# EAGLE schematic DrVetinariClock (EAGLE 6.3)
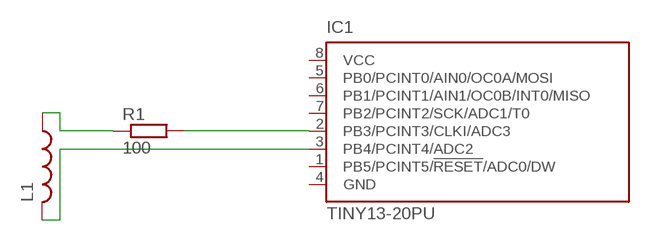
[diagram p0: schematic, sheet 1]

## Parts
IC1  TINY13-20PU  [DIL08]
L1  L-US0204/7  [0204/7]
R1  100  R-EU_0204/7  [0204/7]

## Nets
N$1: IC1.2(PB3/PCINT3/CLKI/ADC3) R1.2
N$2: L1.1 R1.1
N$3: IC1.3(PB4/PCINT4/ADC2) L1.2
Unconnected: IC1.1(PB5/PCINT5/!RESET!/ADC0/DW) IC1.5(PB0/PCINT0/AIN0/OC0A/MOSI) IC1.6(PB1/PCINT1/AIN1/OC0B/INT0/MISO) IC1.7(PB2/PCINT2/SCK/ADC1/T0)

## Power pins joined to a net without a drawn wire
GND: IC1.4(GND)
VCC: IC1.8(VCC)

## Library data of the parts
IC1 = atmel:TINY13: 8-bit AVR Microcontroller with 1K Bytes In-System Programmable Flash Source: http://www.atmel.com/dyn/resources/prod_documents/2535S.pdf; MPN: ATTINY13-20PU; OC_FARNELL: 9171550; OC_NEWARK: 96K6521
L1 = resistor:L-US: INDUCTOR, American symbol
R1 = resistor:R-EU_: RESISTOR, European symbol